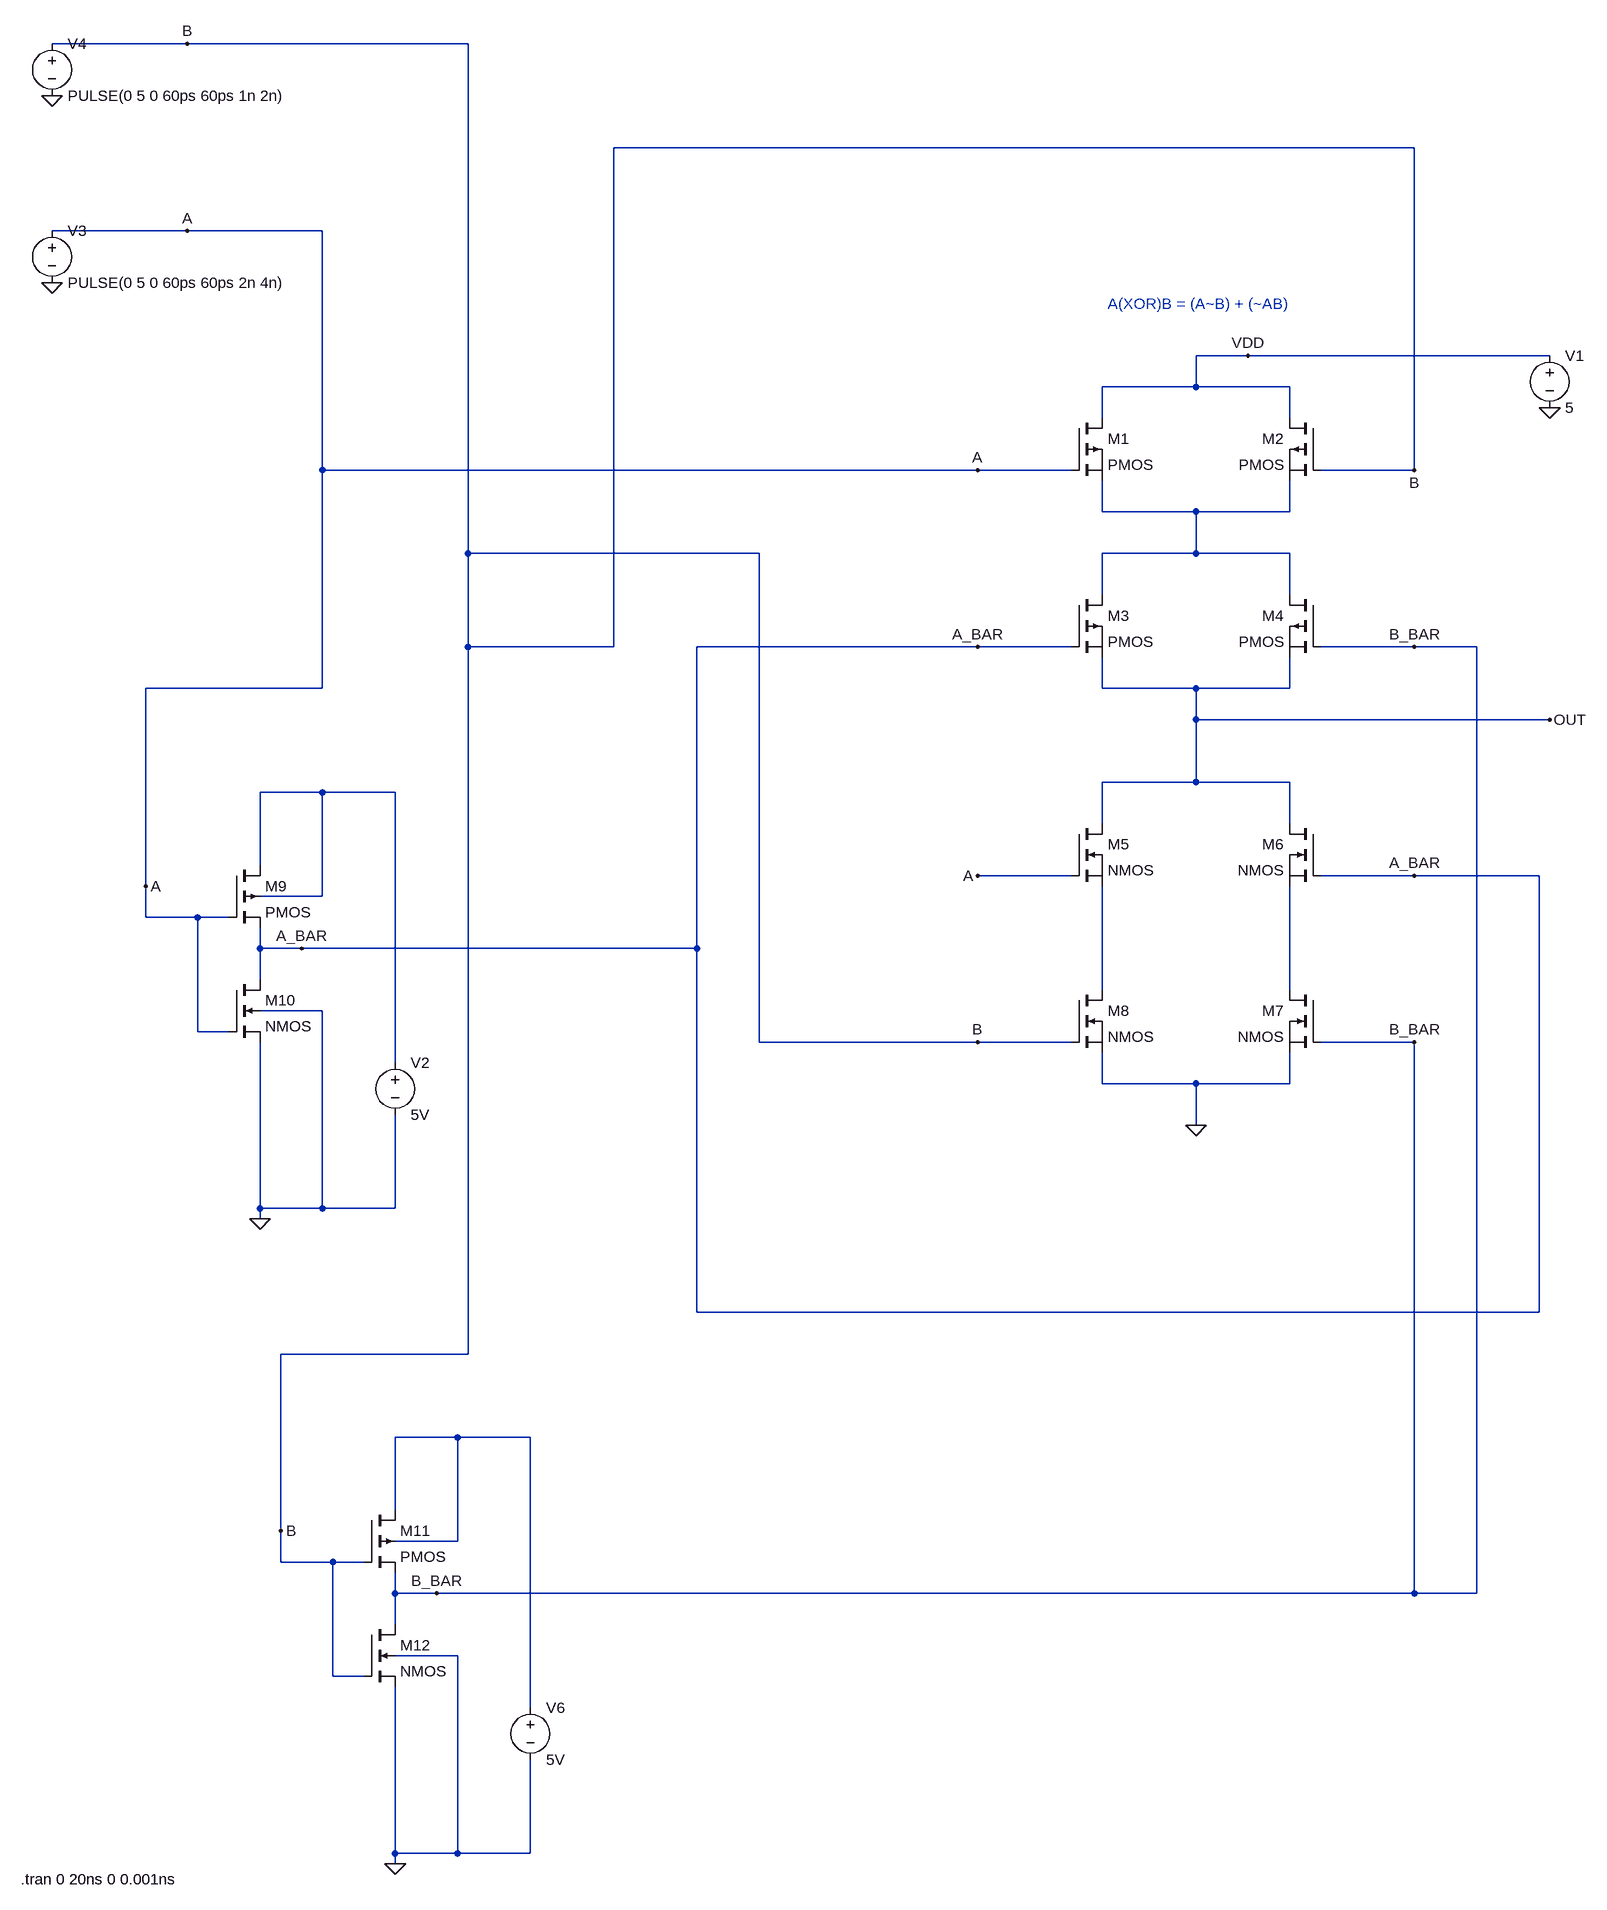
[diagram p0: schematic XOR.asc]
XOR.asc, the LTspice schematic file:
Version 4
SHEET 1 880 3176
WIRE -1696 -384 -1904 -384
WIRE -1264 -384 -1696 -384
WIRE 192 -224 -1040 -224
WIRE -1696 -96 -1904 -96
WIRE -1488 -96 -1696 -96
WIRE -64 96 -144 96
WIRE 400 96 -64 96
WIRE -144 144 -144 96
WIRE -144 144 -288 144
WIRE 0 144 -144 144
WIRE -288 192 -288 144
WIRE 0 192 0 144
WIRE -1488 272 -1488 -96
WIRE -480 272 -1488 272
WIRE -336 272 -480 272
WIRE 192 272 192 -224
WIRE 192 272 48 272
WIRE -288 336 -288 288
WIRE -144 336 -288 336
WIRE 0 336 0 288
WIRE 0 336 -144 336
WIRE -1264 400 -1264 -384
WIRE -816 400 -1264 400
WIRE -144 400 -144 336
WIRE -144 400 -288 400
WIRE 0 400 -144 400
WIRE -288 464 -288 400
WIRE 0 464 0 400
WIRE -1264 544 -1264 400
WIRE -1040 544 -1040 -224
WIRE -1040 544 -1264 544
WIRE -480 544 -912 544
WIRE -336 544 -480 544
WIRE 192 544 48 544
WIRE 288 544 192 544
WIRE -1488 608 -1488 272
WIRE -1488 608 -1760 608
WIRE -288 608 -288 560
WIRE -144 608 -288 608
WIRE 0 608 0 560
WIRE 0 608 -144 608
WIRE -144 656 -144 608
WIRE 400 656 -144 656
WIRE -144 752 -144 656
WIRE -144 752 -288 752
WIRE 0 752 -144 752
WIRE -1488 768 -1584 768
WIRE -1376 768 -1488 768
WIRE -288 816 -288 752
WIRE 0 816 0 752
WIRE -1584 880 -1584 768
WIRE -336 896 -480 896
WIRE 192 896 48 896
WIRE 384 896 192 896
WIRE -1760 912 -1760 608
WIRE -1488 928 -1488 768
WIRE -1488 928 -1584 928
WIRE -1760 960 -1760 912
WIRE -1680 960 -1760 960
WIRE -1632 960 -1680 960
WIRE -1584 1008 -1584 976
WIRE -1520 1008 -1584 1008
WIRE -912 1008 -912 544
WIRE -912 1008 -1520 1008
WIRE -1584 1056 -1584 1008
WIRE -288 1072 -288 912
WIRE 0 1072 0 912
WIRE -1488 1104 -1584 1104
WIRE -1680 1136 -1680 960
WIRE -1632 1136 -1680 1136
WIRE -816 1152 -816 400
WIRE -480 1152 -816 1152
WIRE -336 1152 -480 1152
WIRE 192 1152 48 1152
WIRE -1376 1184 -1376 768
WIRE -288 1216 -288 1168
WIRE -144 1216 -288 1216
WIRE 0 1216 0 1168
WIRE 0 1216 -144 1216
WIRE -144 1280 -144 1216
WIRE -1584 1408 -1584 1152
WIRE -1488 1408 -1488 1104
WIRE -1488 1408 -1584 1408
WIRE -1376 1408 -1376 1264
WIRE -1376 1408 -1488 1408
WIRE -1584 1424 -1584 1408
WIRE -912 1568 -912 1008
WIRE 384 1568 384 896
WIRE 384 1568 -912 1568
WIRE -1264 1632 -1264 544
WIRE -1264 1632 -1552 1632
WIRE -1280 1760 -1376 1760
WIRE -1168 1760 -1280 1760
WIRE -1376 1872 -1376 1760
WIRE -1552 1904 -1552 1632
WIRE -1280 1920 -1280 1760
WIRE -1280 1920 -1376 1920
WIRE -1552 1952 -1552 1904
WIRE -1472 1952 -1552 1952
WIRE -1424 1952 -1472 1952
WIRE -1376 2000 -1376 1968
WIRE -1312 2000 -1376 2000
WIRE 192 2000 192 1152
WIRE 192 2000 -1312 2000
WIRE 288 2000 288 544
WIRE 288 2000 192 2000
WIRE -1376 2048 -1376 2000
WIRE -1280 2096 -1376 2096
WIRE -1472 2128 -1472 1952
WIRE -1424 2128 -1472 2128
WIRE -1168 2176 -1168 1760
WIRE -1376 2400 -1376 2144
WIRE -1280 2400 -1280 2096
WIRE -1280 2400 -1376 2400
WIRE -1168 2400 -1168 2256
WIRE -1168 2400 -1280 2400
WIRE -1376 2416 -1376 2400
FLAG 192 272 B
FLAG -64 96 VDD
FLAG -480 272 A
FLAG 192 544 B_BAR
FLAG -480 544 A_BAR
FLAG 400 656 OUT
FLAG -144 1280 0
FLAG -480 896 A
FLAG 192 896 A_BAR
FLAG -480 1152 B
FLAG 192 1152 B_BAR
FLAG -1584 1424 0
FLAG -1760 912 A
FLAG -1520 1008 A_BAR
FLAG -1904 -304 0
FLAG -1904 -16 0
FLAG -1696 -384 B
FLAG -1696 -96 A
FLAG -1376 2416 0
FLAG -1552 1904 B
FLAG -1312 2000 B_BAR
FLAG 400 176 0
SYMBOL pmos -336 192 R0
SYMATTR InstName M1
SYMBOL pmos 48 192 M0
SYMATTR InstName M2
SYMBOL pmos -336 464 R0
SYMATTR InstName M3
SYMBOL pmos 48 464 M0
SYMATTR InstName M4
SYMBOL nmos -336 816 R0
SYMATTR InstName M5
SYMBOL nmos 48 816 M0
SYMATTR InstName M6
SYMBOL nmos 48 1072 M0
SYMATTR InstName M7
SYMBOL nmos -336 1072 R0
SYMATTR InstName M8
SYMBOL voltage -1376 1168 R0
WINDOW 123 0 0 Left 0
WINDOW 39 0 0 Left 0
SYMATTR InstName V2
SYMATTR Value 5V
SYMBOL pmos4 -1632 880 R0
SYMATTR InstName M9
SYMATTR Value2 l=0.6u w=6u
SYMBOL nmos4 -1632 1056 R0
SYMATTR InstName M10
SYMATTR Value2 l=0.6u w=3u
SYMBOL voltage -1904 -112 R0
WINDOW 123 0 0 Left 0
WINDOW 39 0 0 Left 0
SYMATTR InstName V3
SYMATTR Value PULSE(0 5 0 60ps 60ps 2n 4n)
SYMBOL voltage -1904 -400 R0
WINDOW 123 0 0 Left 0
WINDOW 39 0 0 Left 0
SYMATTR InstName V4
SYMATTR Value PULSE(0 5 0 60ps 60ps 1n 2n)
SYMBOL voltage -1168 2160 R0
WINDOW 123 0 0 Left 0
WINDOW 39 0 0 Left 0
SYMATTR InstName V6
SYMATTR Value 5V
SYMBOL pmos4 -1424 1872 R0
SYMATTR InstName M11
SYMATTR Value2 l=0.6u w=6u
SYMBOL nmos4 -1424 2048 R0
SYMATTR InstName M12
SYMATTR Value2 l=0.6u w=3u
SYMBOL voltage 400 80 R0
SYMATTR InstName V1
SYMATTR Value 5
TEXT -280 16 Left 2 ;A(XOR)B = (A~B) + (~AB)
TEXT -1952 2440 Left 2 !.tran 0 20ns 0 0.001ns

The netlist it stands for:
* XOR.asc
M1 VDD A N001 N001 PMOS
M2 VDD B N001 N001 PMOS
M3 N001 A_BAR OUT OUT PMOS
M4 N001 B_BAR OUT OUT PMOS
M5 OUT A N003 N003 NMOS
M6 OUT A_BAR N004 N004 NMOS
M7 N004 B_BAR 0 0 NMOS
M8 N003 B 0 0 NMOS
V2 N002 0 5V
M9 N002 A A_BAR N002 PMOS l=0.6u w=6u
M10 A_BAR A 0 0 NMOS l=0.6u w=3u
V3 A 0 PULSE(0 5 0 60ps 60ps 2n 4n)
V4 B 0 PULSE(0 5 0 60ps 60ps 1n 2n)
V6 N005 0 5V
M11 N005 B B_BAR N005 PMOS l=0.6u w=6u
M12 B_BAR B 0 0 NMOS l=0.6u w=3u
V1 VDD 0 5
.model NMOS NMOS
.model PMOS PMOS
.lib standard.mos
* A(XOR)B = (A~B) + (~AB)
.tran 0 20ns 0 0.001ns
.backanno
.end